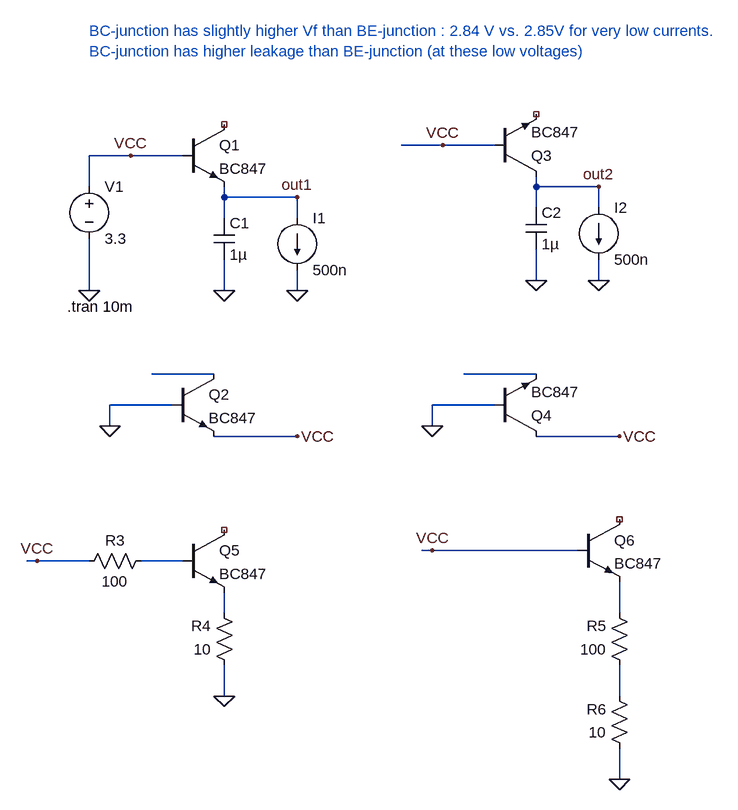
[diagram p0: schematic diode_charging.asc]
diode_charging.asc, the LTspice schematic file:
Version 4
SHEET 1 1048 1140
WIRE 544 144 480 144
WIRE 624 144 544 144
WIRE 64 160 0 160
WIRE 144 160 64 160
WIRE 0 208 0 160
WIRE 688 208 688 192
WIRE 784 208 688 208
WIRE 208 224 208 208
WIRE 320 224 208 224
WIRE 688 240 688 208
WIRE 784 240 784 208
WIRE 208 256 208 224
WIRE 320 256 320 224
WIRE 688 352 688 304
WIRE 784 352 784 320
WIRE 0 368 0 288
WIRE 208 368 208 320
WIRE 320 368 320 336
WIRE 192 496 96 496
WIRE 688 496 576 496
WIRE 128 544 32 544
WIRE 624 544 528 544
WIRE 32 576 32 544
WIRE 528 576 528 544
WIRE 320 592 192 592
WIRE 816 592 688 592
WIRE 528 768 512 768
WIRE 752 768 528 768
WIRE -80 784 -96 784
WIRE 0 784 -80 784
WIRE 144 784 80 784
WIRE 208 864 208 832
WIRE 816 864 816 816
WIRE 208 992 208 944
WIRE 816 992 816 944
WIRE 816 1120 816 1072
FLAG 0 368 0
FLAG 208 368 0
FLAG 320 368 0
FLAG 688 352 0
FLAG 784 352 0
FLAG 320 224 out1
FLAG 784 208 out2
FLAG 64 160 VCC
FLAG 544 144 VCC
FLAG 320 592 VCC
FLAG 32 576 0
FLAG 816 592 VCC
FLAG 528 576 0
FLAG 208 992 0
FLAG -80 784 VCC
FLAG 816 1120 0
FLAG 528 768 VCC
SYMBOL npn 144 112 R0
SYMATTR InstName Q1
SYMATTR Value BC847
SYMBOL cap 192 256 R0
SYMATTR InstName C1
SYMATTR Value 1µ
SYMBOL voltage 0 192 R0
SYMATTR InstName V1
SYMATTR Value 3.3
SYMBOL cap 672 240 R0
SYMATTR InstName C2
SYMATTR Value 1µ
SYMBOL npn 624 192 M180
SYMATTR InstName Q3
SYMATTR Value BC847
SYMBOL npn 128 496 R0
SYMATTR InstName Q2
SYMATTR Value BC847
SYMBOL npn 624 592 M180
SYMATTR InstName Q4
SYMATTR Value BC847
SYMBOL npn 144 736 R0
SYMATTR InstName Q5
SYMATTR Value BC847
SYMBOL res 96 768 R90
WINDOW 0 0 56 VBottom 2
WINDOW 3 32 56 VTop 2
SYMATTR InstName R3
SYMATTR Value 100
SYMBOL res 224 960 R180
WINDOW 0 36 76 Left 2
WINDOW 3 36 40 Left 2
SYMATTR InstName R4
SYMATTR Value 10
SYMBOL npn 752 720 R0
SYMATTR InstName Q6
SYMATTR Value BC847
SYMBOL res 832 960 R180
WINDOW 0 36 76 Left 2
WINDOW 3 36 40 Left 2
SYMATTR InstName R5
SYMATTR Value 100
SYMBOL res 832 1088 R180
WINDOW 0 36 76 Left 2
WINDOW 3 36 40 Left 2
SYMATTR InstName R6
SYMATTR Value 10
SYMBOL current 320 256 R0
WINDOW 123 0 0 Left 0
WINDOW 39 0 0 Left 0
SYMATTR InstName I1
SYMATTR Value 500n
SYMBOL current 784 240 R0
WINDOW 123 0 0 Left 0
WINDOW 39 0 0 Left 0
SYMATTR InstName I2
SYMATTR Value 500n
TEXT -34 392 Left 2 !.tran 10m
TEXT 0 -32 Left 2 ;BC-junction has slightly higher Vf than BE-junction : 2.84 V vs. 2.85V for very low currents.\nBC-junction has higher leakage than BE-junction (at these low voltages)

The netlist it stands for:
* diode_charging.asc
Q1 NC_01 VCC out1 0 BC847
C1 out1 0 1µ
V1 VCC 0 3.3
C2 out2 0 1µ
Q3 out2 VCC NC_02 0 BC847
Q2 N001 0 VCC 0 BC847
Q4 VCC 0 N002 0 BC847
Q5 NC_03 N003 N004 0 BC847
R3 N003 VCC 100
R4 0 N004 10
Q6 NC_04 VCC N005 0 BC847
R5 N006 N005 100
R6 0 N006 10
I1 out1 0 500n
I2 out2 0 500n
.model NPN NPN
.model PNP PNP
.lib standard.bjt
.tran 10m
* BC-junction has slightly higher Vf than BE-junction : 2.84 V vs. 2.85V for very low currents.
* BC-junction has higher leakage than BE-junction (at these low voltages)
.backanno
.end